# Altium schematic sheet RS-485.SchDoc
size A4
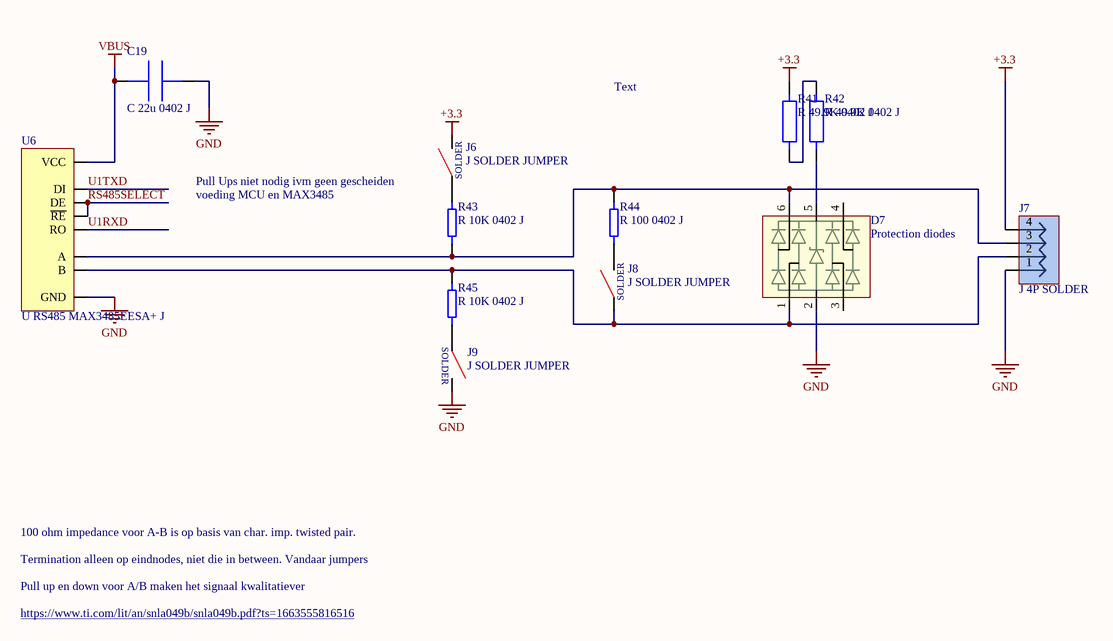
[diagram p0: RS-485.SchDoc]

## Parts
C19  C 22u 0402 J  [C0402]
D7  Protection diodes  [SOT23-SRV05]
J6  J SOLDER JUMPER  [SOLDER_JUMPER]  (no BOM)
J7  J 4P SOLDER  [4P SOLDER BRIDGE]  (no BOM)
J8  J SOLDER JUMPER  [SOLDER_JUMPER]  (no BOM)
J9  J SOLDER JUMPER  [SOLDER_JUMPER]  (no BOM)
R41  R 49.9K 0402 J  [R0402]
R42  R 49.9K 0402 J  [R0402]
R43  R 10K 0402 J  [R0402]
R44  R 100 0402 J  [R0402]
R45  R 10K 0402 J  [R0402]
U6  U RS485 MAX3485EESA+ J  [SOIC8 - V2]

## Nets
+3.3: J6.2 J7.4(SEL) R41.2
GND: C19.2 D7.2 J7.1(VDD) J9.2 U6.5(GND)
VBUS: C19.1 U6.8(VCC)
RS485SELECT: U6.2(~{RE}) U6.3(DE)
U1RXD: U6.1(RO)
U1TXD: U6.4(DI)
NetD7_1: D7.1 J7.2(SDA) J8.1 R45.2 U6.7(B)
NetD7_5: D7.5 R42.1
NetD7_6: D7.6 J7.3(SCL) R43.1 R44.2 U6.6(A)
NetJ6_1: J6.1 R43.2
NetJ8_2: J8.2 R44.1
NetJ9_1: J9.1 R45.1
NetR41_1: R41.1 R42.2

Not connected (* = marked no-connect by the designer): D7 3 4

## Notes on the sheet
- Text
- Pull Ups niet nodig ivm geen gescheiden
- voeding MCU en MAX3485
- 100 ohm impedance voor A-B is op basis van char. imp. twisted pair.
- Termination alleen op eindnodes, niet die in between. Vandaar jumpers
- Pull up en down voor A/B maken het signaal kwalitatiever
- https://www.ti.com/lit/an/snla049b/snla049b.pdf?ts=1663555816516
- (in symbol J SOLDER JUMPER) SOLDER

## Library data of the parts
C19 = C 22u 0402 J: Multi-Layer Ceramic Capacitor 22uF 2.5VDC X6S 20% 0402 Paper T/R GRM155C80E226ME11D; Manufacturer: Murata; Supplier 1: Mouser; Manufacturer Part Number: GRM155C80E226ME11D; RoHS: Yes; Category: Ceramic Capacitors; Stock 1: 30000; Pricing 1: 1=0,32000, 10=0,22300, 50=0,22300, 100=0,13400, 1000=0,08500, 10000=0,06900 (USD); Supplier Part Number 1: 81-GRM155C80E226ME1D; JLCPCB: C907955
D7 = D SRV05-4.TCT: SEMTECH - SRV05-4.TCT - ESD Protection Device, TVS, 17.5 V, SOT-23, 6 Pins, 5 V, 300 W; Capacitance: 5pF; Direction: Unidirectional; Reverse Breakdown Voltage: 6V; Number of Elements: 1; Number of Channels: 4; Operating Supply Voltage: 5V; Clamping Voltage: 17.5V; Peak Pulse Power: 300W; Power Line Protection: Yes; Leakage Current: 5uA; Peak Pulse Current: 12A; Test Current: 1mA; Current: 5A; Supplier 1: RSComponents; Manufacturer: Semtech; Manufacturer Part Number: SRV05-4.TCT; RoHS: Yes; Category: TVS Diodes; Stock 1: 425; Pricing 1: 5=1,18100, 25=0,88900, 50=0,77200, 125=0,72400, 250=0,69400 (USD); Mount: Surface Mount; Case/Package: SOT-23; Number of Pins: 6; Min Operating Temperature: -55°C; Max Operating Temperature: 125°C; Packaging: Tape and Reel; Number of Bidirectional Channels: 4; Reverse Standoff Voltage: 5V; Min Breakdown Voltage: 6V; Polarity: Unidirectional; Working Voltage: 5V; ESD Protection: Yes; Max Reverse Leakage Current: 5uA; Max Breakdown Voltage: 6V; Max Power Dissipation: 300W; Voltage Rating (DC): 5V; Breakdown Voltage: 6V; Voltage: 5V; Series: RailClamp®, SR; Clamping Voltage-Max: 17.5V; Length: 2.9mm; Width: 1.6mm; Height: 1.15mm; Depth: 1.6mm; Radiation Hardening: No; REACH SVHC: No SVHC; Lead Free: Lead Free; RoHS Compliant: Yes; ComponentLink1URL: https://datasheet.ciiva.com/18065/getdatasheetpartid-93542-18065216.pdf?src-supplier=Verical; ComponentLink1Description: https://datasheet.ciiva.com/18065/getdatasheetpartid-93542-18065216.pdf?src-supplier=Verical; ComponentLink2URL: https://datasheet.ciiva.com/8029/srv05-4-8029973.pdf?src-supplier=Element14; ComponentLink2Description: https://datasheet.ciiva.com/8029/srv05-4-8029973.pdf?src-supplier=Element14; ComponentLink3URL: https://datasheet.ciiva.com/26787/srv05-4-tct-26787453.pdf?src-supplier=IIIC; ComponentLink3Description: https://datasheet.ciiva.com/26787/srv05-4-tct-26787453.pdf?src-supplier=IIIC; ComponentLink4URL: https://datasheet.ciiva.com/11193/srv05-4-11193639.pdf?src-supplier=Avnet; ComponentLink4Description: https://datasheet.ciiva.com/11193/srv05-4-11193639.pdf?src-supplier=Avnet; ComponentLink5URL: https://datasheet.ciiva.com/16396/srv05-4-16396600.pdf?src-supplier=Future+Electronics; ComponentLink5Description: https://datasheet.ciiva.com/16396/srv05-4-16396600.pdf?src-supplier=Future+Electronics; ComponentLink6URL: https://datasheet.ciiva.com/25955/srv05-4-25955769.pdf?src-supplier=Avnet+Europe; ComponentLink6Description: https://datasheet.ciiva.com/25955/srv05-4-25955769.pdf?src-supplier=Avnet+Europe; ComponentLink7URL: https://datasheet.ciiva.com/338/srv05-4-338860.pdf?src-supplier=Digi-Key; ComponentLink7Description: https://datasheet.ciiva.com/338/srv05-4-338860.pdf?src-supplier=Digi-Key; ComponentLink8URL: https://datasheet.ciiva.com/338/srv05-4-338861.pdf?src-supplier=Digi-Key; ComponentLink8Description: https://datasheet.ciiva.com/338/srv05-4-338861.pdf?src-supplier=Digi-Key; ComponentLink9URL: https://datasheet.ciiva.com/338/srv05-4-338862.pdf?src-supplier=Digi-Key; ComponentLink9Description: https://datasheet.ciiva.com/338/srv05-4-338862.pdf?src-supplier=Digi-Key; Supplier Part Number 1: 6910883; JLCPCB: C13612
J8 = J SOLDER JUMPER: No-BOM solder jumper (test method)
R41 R42 = R 49.9K 0402 J: Res General Purpose Thick Film 0402 49.9K Ohm 1% 1/16W ±100ppm/°C Molded SMD Paper T/R RC0402FR-0749K9L; Manufacturer: Yageo; Power Rating: 62.5mW; Resistance: 49.9kR; Voltage Rating: 50V; Max Power Dissipation: 63mW; Supplier 1: Arrow Electronics; Manufacturer Part Number: RC0402FR-0749K9L; RoHS: Yes; Category: Chip SMD Resistors; Stock 1: 3590000; Pricing 1: 10000=0,00180, 30000=0,00160, 50000=0,00140, 100000=0,00140 (USD); Case/Package: 0402; Case Code (Imperial): 0402; Case Code (Metric): 1005; Size Code: 0402; Min Operating Temperature: -55°C; Max Operating Temperature: 155°C; Tolerance: 1%; Packaging: Tape and Reel; Termination: SMD/SMT; Resistor Type: Thick Film; Temperature Coefficient: 100ppm/°C; Voltage Rating (DC): 50V; Features: Moisture Resistant; Series: RC; Number of Terminations: 2; Construction: Rectangular; Length: 1mm; Depth: 0.5mm; Military Standard: Not; Lead Free: Lead Free; RoHS Compliant: Yes; ComponentLink1URL: https://datasheet.ciiva.com/17071/pyu-rc0402-51-rohs-l-6-r-17071066.pdf?src-supplier=Future+Electronics; ComponentLink1Description: https://datasheet.ciiva.com/17071/pyu-rc0402-51-rohs-l-6-r-17071066.pdf?src-supplier=Future+Electronics; Supplier 2: RSComponents; Stock 2: 9900; Pricing 2: 10000=0,00200, 50000=0,00200, 100000=0,00200, 200000=0,00200, 400000=0,00200 (GBP); Supplier 3: Digi-Key; Stock 3: 8421822; Pricing 3: 1=0,10000, 10=0,01500, 100=0,00610, 1000=0,00275, 2500=0,00239, 5000=0,00197 (USD); Supplier 4: Mouser; Stock 4: 1268211; Pricing 4: 1=0,10000, 10=0,01800, 50=0,01800, 100=0,00800, 1000=0,00500, 10000=0,00200 (USD); JLCPCB: C137969; Supplier Part Number 2: 1987804; Supplier Part Number 3: 311-49.9KLRDKR-ND; Supplier Part Number 4: 603-RC0402FR-0749K9L; Supplier Part Number 1: RC0402FR-0749K9L
R43 R45 = R 10K 0402 J: Res Thick Film 0402 10K Ohm 1% 0.063W(1/16W) ±100ppm/C Pad SMD Automotive T/R AC0402FR-0710KL; Manufacturer: Yageo; Resistance: 10kR; Power Rating: 62.5mW; Voltage Rating: 50V; Temperature Coefficient: 100ppm/°C; Max Power Dissipation: 63mW; Supplier 1: Arrow Electronics; Manufacturer Part Number: AC0402FR-0710KL; RoHS: Yes; Category: Chip SMD Resistors; Stock 1: 46; Pricing 1: 1=0,08140, 10=0,02850, 25=0,02750 (USD); Case/Package: 0402; Case Code (Imperial): 0402; Case Code (Metric): 1005; Size Code: 0402; Min Operating Temperature: -55°C; Max Operating Temperature: 155°C; Tolerance: 1%; Packaging: Tape and Reel; Resistor Type: Thick Film; Termination: SMD/SMT; Number of Terminations: 2; Features: Moisture Resistant,Automotive AEC-Q200; Series: AC; Construction: Rectangular; Length: 0.039inch; Width: 0.02inch; Height: 0.015inch; Depth: 0.5mm; Military Standard: Not; Lead Free: Lead Free; RoHS Compliant: Yes; ComponentLink1URL: https://datasheet.ciiva.com/12656/pyu-ac-51-rohs-l-2-12656634.pdf?src-supplier=Mouser; ComponentLink1Description: https://datasheet.ciiva.com/12656/pyu-ac-51-rohs-l-2-12656634.pdf?src-supplier=Mouser; Supplier 2: RSComponents; Stock 2: 17000; Pricing 2: 10000=0,00200 (GBP); Supplier 3: Digi-Key; Stock 3: 1574588; Pricing 3: 1=0,10000, 10=0,02000, 100=0,00830, 1000=0,00371, 2500=0,00322, 5000=0,00266 (USD); Supplier 4: Mouser; Stock 4: 3990115; Pricing 4: 1=0,10000, 10=0,01500, 50=0,01500, 100=0,00700, 1000=0,00300, 5000=0,00200, 10000=0,00200 (USD); Supplier Part Number 1: AC0402FR-0710KL; Supplier Part Number 2: 1977965; Supplier Part Number 3: YAG3436CT-ND; Supplier Part Number 4: 603-AC0402FR-0710KL; JLCPCB: C144807
R44 = R 100 0402 J: Res General Purpose Thick Film 0402 100 Ohm 5% 1/16W ±100ppm/°C Molded SMD Paper T/R RC0402JR-07100RL; Manufacturer: Yageo; Resistance: 100R; Power Rating: 63mW; Voltage Rating: 50V; Supplier 1: Arrow Electronics; Manufacturer Part Number: RC0402JR-07100RL; RoHS: Yes; Category: Chip SMD Resistors; Stock 1: 7500000; Pricing 1: 10000=0,00120, 30000=0,00110, 100000=0,00100 (USD); Case/Package: 0402; Case Code (Metric): 1005; Case Code (Imperial): 0402; Weight: 2.3E-05oz; Size Code: 0402; Min Operating Temperature: -55°C; Max Operating Temperature: 155°C; Tolerance: 5%; Packaging: Tape and Reel; Package Quantity: 1; Resistor Type: Thick Film; Number of Terminations: 2; Termination: SMD/SMT; Max Power Dissipation: 63mW; Temperature Coefficient: 100ppm/°C; Features: Moisture Resistant; Series: RC; Resistance Tolerance: 5%; Construction: Rectangular; Length: 1mm; Width: 0.02inch; Height: 0.016inch; Depth: 0.5mm; REACH SVHC: No SVHC; Military Standard: Not; Lead Free: Lead Free; RoHS Compliant: Yes; ComponentLink1URL: https://datasheet.ciiva.com/46394/1018594-46394943.pdf?src-supplier=Element14; ComponentLink1Description: https://datasheet.ciiva.com/46394/1018594-46394943.pdf?src-supplier=Element14; ComponentLink2URL: https://datasheet.ciiva.com/2452/pyu-r-int-thick-7-2452618.pdf?src-supplier=Digi-Key; ComponentLink2Description: https://datasheet.ciiva.com/2452/pyu-r-int-thick-7-2452618.pdf?src-supplier=Digi-Key; ComponentLink3URL: https://datasheet.ciiva.com/2452/pyu-r-int-thick-7-2452619.pdf?src-supplier=Digi-Key; ComponentLink3Description: https://datasheet.ciiva.com/2452/pyu-r-int-thick-7-2452619.pdf?src-supplier=Digi-Key; ComponentLink4URL: https://datasheet.ciiva.com/2452/pyu-r-int-thick-7-2452617.pdf?src-supplier=Digi-Key; ComponentLink4Description: https://datasheet.ciiva.com/2452/pyu-r-int-thick-7-2452617.pdf?src-supplier=Digi-Key; ComponentLink5URL: https://datasheet.ciiva.com/12577/pyu-rc0402-51-rohs-l-6-r-12577725.pdf?src-supplier=Mouser; ComponentLink5Description: https://datasheet.ciiva.com/12577/pyu-rc0402-51-rohs-l-6-r-12577725.pdf?src-supplier=Mouser; ComponentLink6URL: https://datasheet.ciiva.com/7850/1018594-7850135.pdf?src-supplier=Element14; ComponentLink6Description: https://datasheet.ciiva.com/7850/1018594-7850135.pdf?src-supplier=Element14; ComponentLink7URL: https://datasheet.ciiva.com/7850/1018594-7850134.pdf?src-supplier=Element14; ComponentLink7Description: https://datasheet.ciiva.com/7850/1018594-7850134.pdf?src-supplier=Element14; ComponentLink8URL: https://datasheet.ciiva.com/16740/pyu-rc0402-51-rohs-l-6-r-16740924.pdf?src-supplier=Future+Electronics; ComponentLink8Description: https://datasheet.ciiva.com/16740/pyu-rc0402-51-rohs-l-6-r-16740924.pdf?src-supplier=Future+Electronics; Supplier 2: RSComponents; Stock 2: 25100; Pricing 2: 1000=0,00400, 2500=0,00400, 5000=0,00400, 10000=0,00300 (GBP); Supplier 3: Digi-Key; Stock 3: 12189062; Pricing 3: 1=0,10000, 10=0,01200, 100=0,00500, 1000=0,00225, 2500=0,00195, 5000=0,00161 (USD); Supplier 4: Mouser; Stock 4: 1266422; Pricing 4: 1=0,10000, 10=0,01000, 50=0,01000, 100=0,00500, 1000=0,00200, 10000=0,00100 (USD); JLCPCB: C106233; Supplier Part Number 3: 311-100JRCT-ND; Supplier Part Number 4: 603-RC0402JR-07100RL; Supplier Part Number 1: RC0402JR-07100RL; Supplier Part Number 2: 1987887P
U6 = U RS485 MAX3485EESA+ J: Single Transmitter/Receiver RS-422/RS-485 8-Pin SOIC N; Manufacturer: Maxim; Data Rate: 15Mbps; Number of Receivers: 1; Max Supply Voltage: 3.6V; Min Supply Voltage: 3V; Operating Supply Voltage: 3.3V; Max Power Dissipation: 471mW; Output Current: 20uA; Propagation Delay: 62ns; Interface: RS-422,RS-485; Logic Function: Transceiver; Simplex/Duplex: Half Duplex; Operating Supply Current: 1.1mA; Supplier 1: RSComponents; Manufacturer Part Number: MAX3485EESA+; RoHS: Yes; Category: RS-232 / RS-422 / RS-485 Interface ICs; Stock 1: 4140; Pricing 1: 25=6,27000, 50=5,80800, 125=5,54400 (GBP); Mount: Surface Mount; Case/Package: SOIC; Number of Pins: 8; Contact Plating: Tin,Matte; Weight: 0.019048oz; Min Operating Temperature: -40°C; Max Operating Temperature: 85°C; Packaging: Rail/Tube; Package Quantity: 100; Number of Transmitters: 1; Output Voltage: 3V; Number of Drivers: 1; Number of Transceivers: 1; Series: -; Length: 5mm; Width: 4mm; Height: 1.5mm; Radiation Hardening: No; RoHS Compliant: Yes; REACH SVHC: No SVHC; ComponentLink1URL: https://datasheet.ciiva.com/1714/max3483e-max3491e-1714390.pdf?src-supplier=Digi-Key; ComponentLink1Description: https://datasheet.ciiva.com/1714/max3483e-max3491e-1714390.pdf?src-supplier=Digi-Key; ComponentLink2URL: https://datasheet.ciiva.com/3028/max3483e-max3491e-3028632.pdf?src-supplier=Avnet; ComponentLink2Description: https://datasheet.ciiva.com/3028/max3483e-max3491e-3028632.pdf?src-supplier=Avnet; Supplier 2: Mouser; Pricing 2: 1=7,18000, 10=6,49000, 50=6,19000, 100=5,37000, 1000=5,12000, 10000=5,12000 (USD); Supplier Part Number 1: 1901234P; Supplier Part Number 2: 700-MAX3485EESA; JLCPCB: C9943